# EAGLE design trif M (EAGLE 6.1)
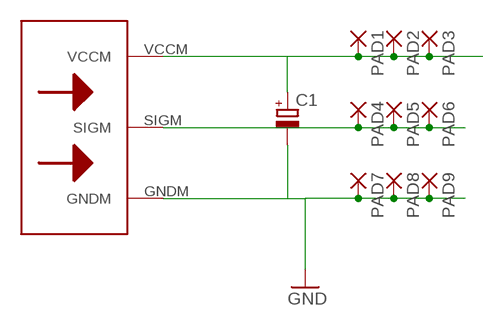
[diagram p0: schematic, sheet 1]

## Parts
C1  CPOL-EU153CLV-1012  [153CLV-1012]
PAD1  SMD2  [SMD1,27-2,54]
PAD2  SMD2  [SMD1,27-2,54]
PAD3  SMD2  [SMD1,27-2,54]
PAD4  SMD2  [SMD1,27-2,54]
PAD5  SMD2  [SMD1,27-2,54]
PAD6  SMD2  [SMD1,27-2,54]
PAD7  SMD2  [SMD1,27-2,54]
PAD8  SMD2  [SMD1,27-2,54]
PAD9  SMD2  [SMD1,27-2,54]
U$1  BITWIREM  [BITWIREM]

## Nets
N$1: PAD4.1(P) PAD5.1(P) PAD6.1(P) U$1.SIGM
N$2: C1.+ PAD1.1(P) PAD2.1(P) PAD3.1(P) U$1.VCCM
N$8: C1.- PAD7.1(P) PAD8.1(P) PAD9.1(P) U$1.GNDM ; supply symbol labelled GND

## Library data of the parts
C1 = rcl:CPOL-EU: POLARIZED CAPACITOR, European symbol
PAD1-PAD9 = wirepad:SMD2: SMD PAD
U$1 = bigbits:BITWIREM: BitWire Male Entrada de Sínal <<---

## Board
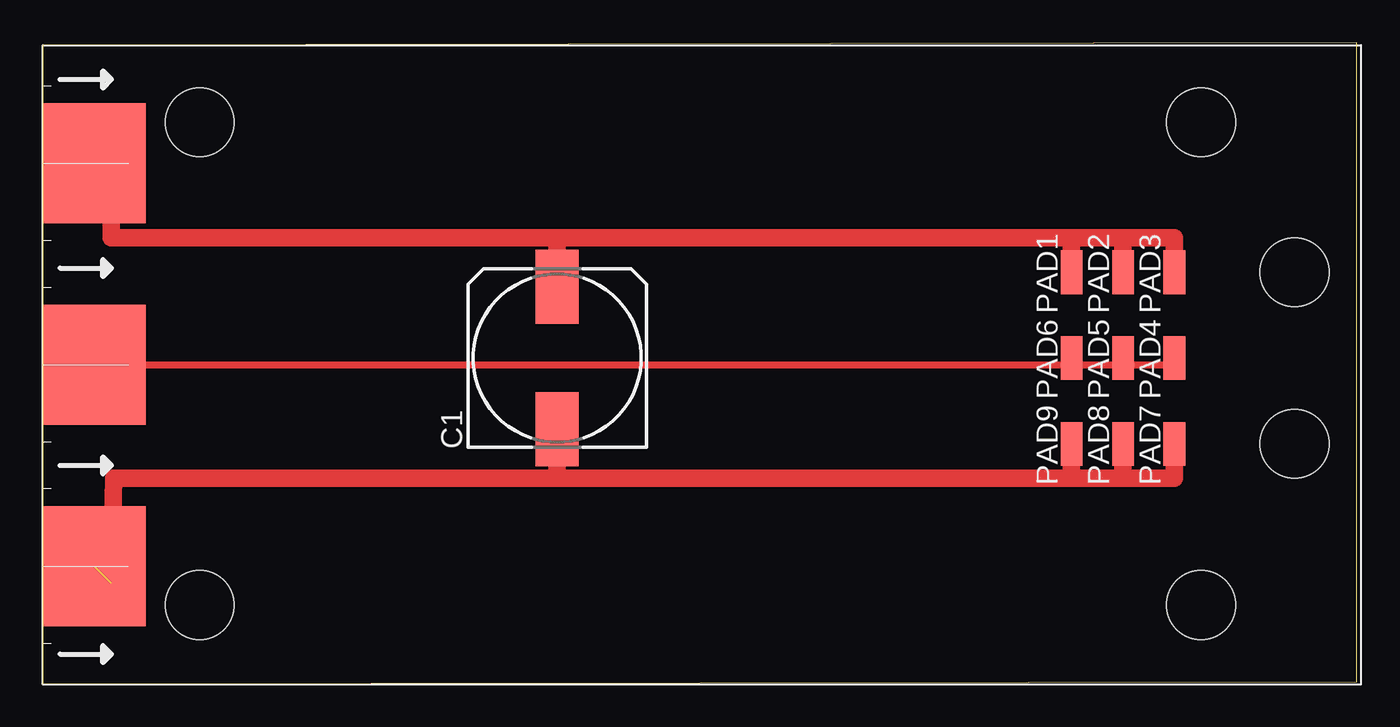
[diagram p1: board, top side]

Size 76.62 x 37.38 mm. Coordinates in mm from the lower left corner, seen from the top.
Outline: 0,0 76.62,0.12 76.62,37.38 0,37.25 0,0
Copper layers (1*16): Top 0.035mm / dielectric 1.5mm / Bottom 0.035mm
Design rules: minimum track width 10mil, minimum drill 24mil, track to track 8mil, track to pad 8mil, pad to pad 8mil, via to via 8mil, smd to smd 8mil, copper to edge 40mil, drill to drill 8mil, minimum pad ring 10mil, minimum via ring 8mil, stop-mask expansion 4mil, vias tented up to drill 0mil, thermal gap 10mil
Holes 4 mm at 73,24 73,14

### Footprints (pad centres in the part's own frame; a part is rotated, then mirrored left to right if it is on the bottom)
153CLV-1012 = smd 4.3 x 2.5: + 4.15,0; - -4.15,0
SMD1,27-2,54 = smd 1.27 x 2.54: 1 0,0
BITWIREM = smd 6 x 7: GNDM 3,-30.39; SIGM 3,-18.65; VCCM 3,-6.9 | hole 4: 9.15,-4.5; 9.15,-32.64; 67.55,-4.5; 67.55,-32.64

### Placement (x,y rotation side)
C1  30,19 90 top
PAD1  60,24 0 top
PAD2  63,24 0 top
PAD3  66,24 0 top
PAD4  66,19 0 top
PAD5  63,19 0 top
PAD6  60,19 0 top
PAD7  66,14 0 top
PAD8  63,14 0 top
PAD9  60,14 0 top
U$1  0,37.25 0 top

### Tracks (layer width: path | path; a pad name or v marks a point on that pad's centre or on a via)
N$1
  Top 0.406: U$1.SIGM 60,18.6 | 60,18.6 63,18.6 | 63,18.6 66,18.6 PAD4.1 | PAD6.1 60,18.6 | PAD5.1 63,18.6
N$2
  Top 0.406: U$1.VCCM 4,30.35
  Top 1.016: 4,30.35 4,26 30,26 | 30,26 60,26 | 60,26 63,26 | 63,26 66,26 PAD3.1 | C1.+ 30,26 | PAD1.1 60,26 | PAD2.1 63,26
N$8  (1 unrouted)
  Top 1.016: 4,5.86 4.12,12 30,12 | 30,12 60,12 | 60,12 63,12 | 63,12 66,12 PAD7.1 | C1.- 30,12 | PAD8.1 63,12 | PAD9.1 60,12